# EasyEDA Pro project controller_2.eprj

# Schematic Schematic
Board Name: controller_2; Create Date: 2026-01-03; Page Name: P1; Project Name: controller_2; Schematic Name: Schematic2; Update Date: 2026-01-03; Company: EasyEDA.com; Page Size: A4; Version: V1.0
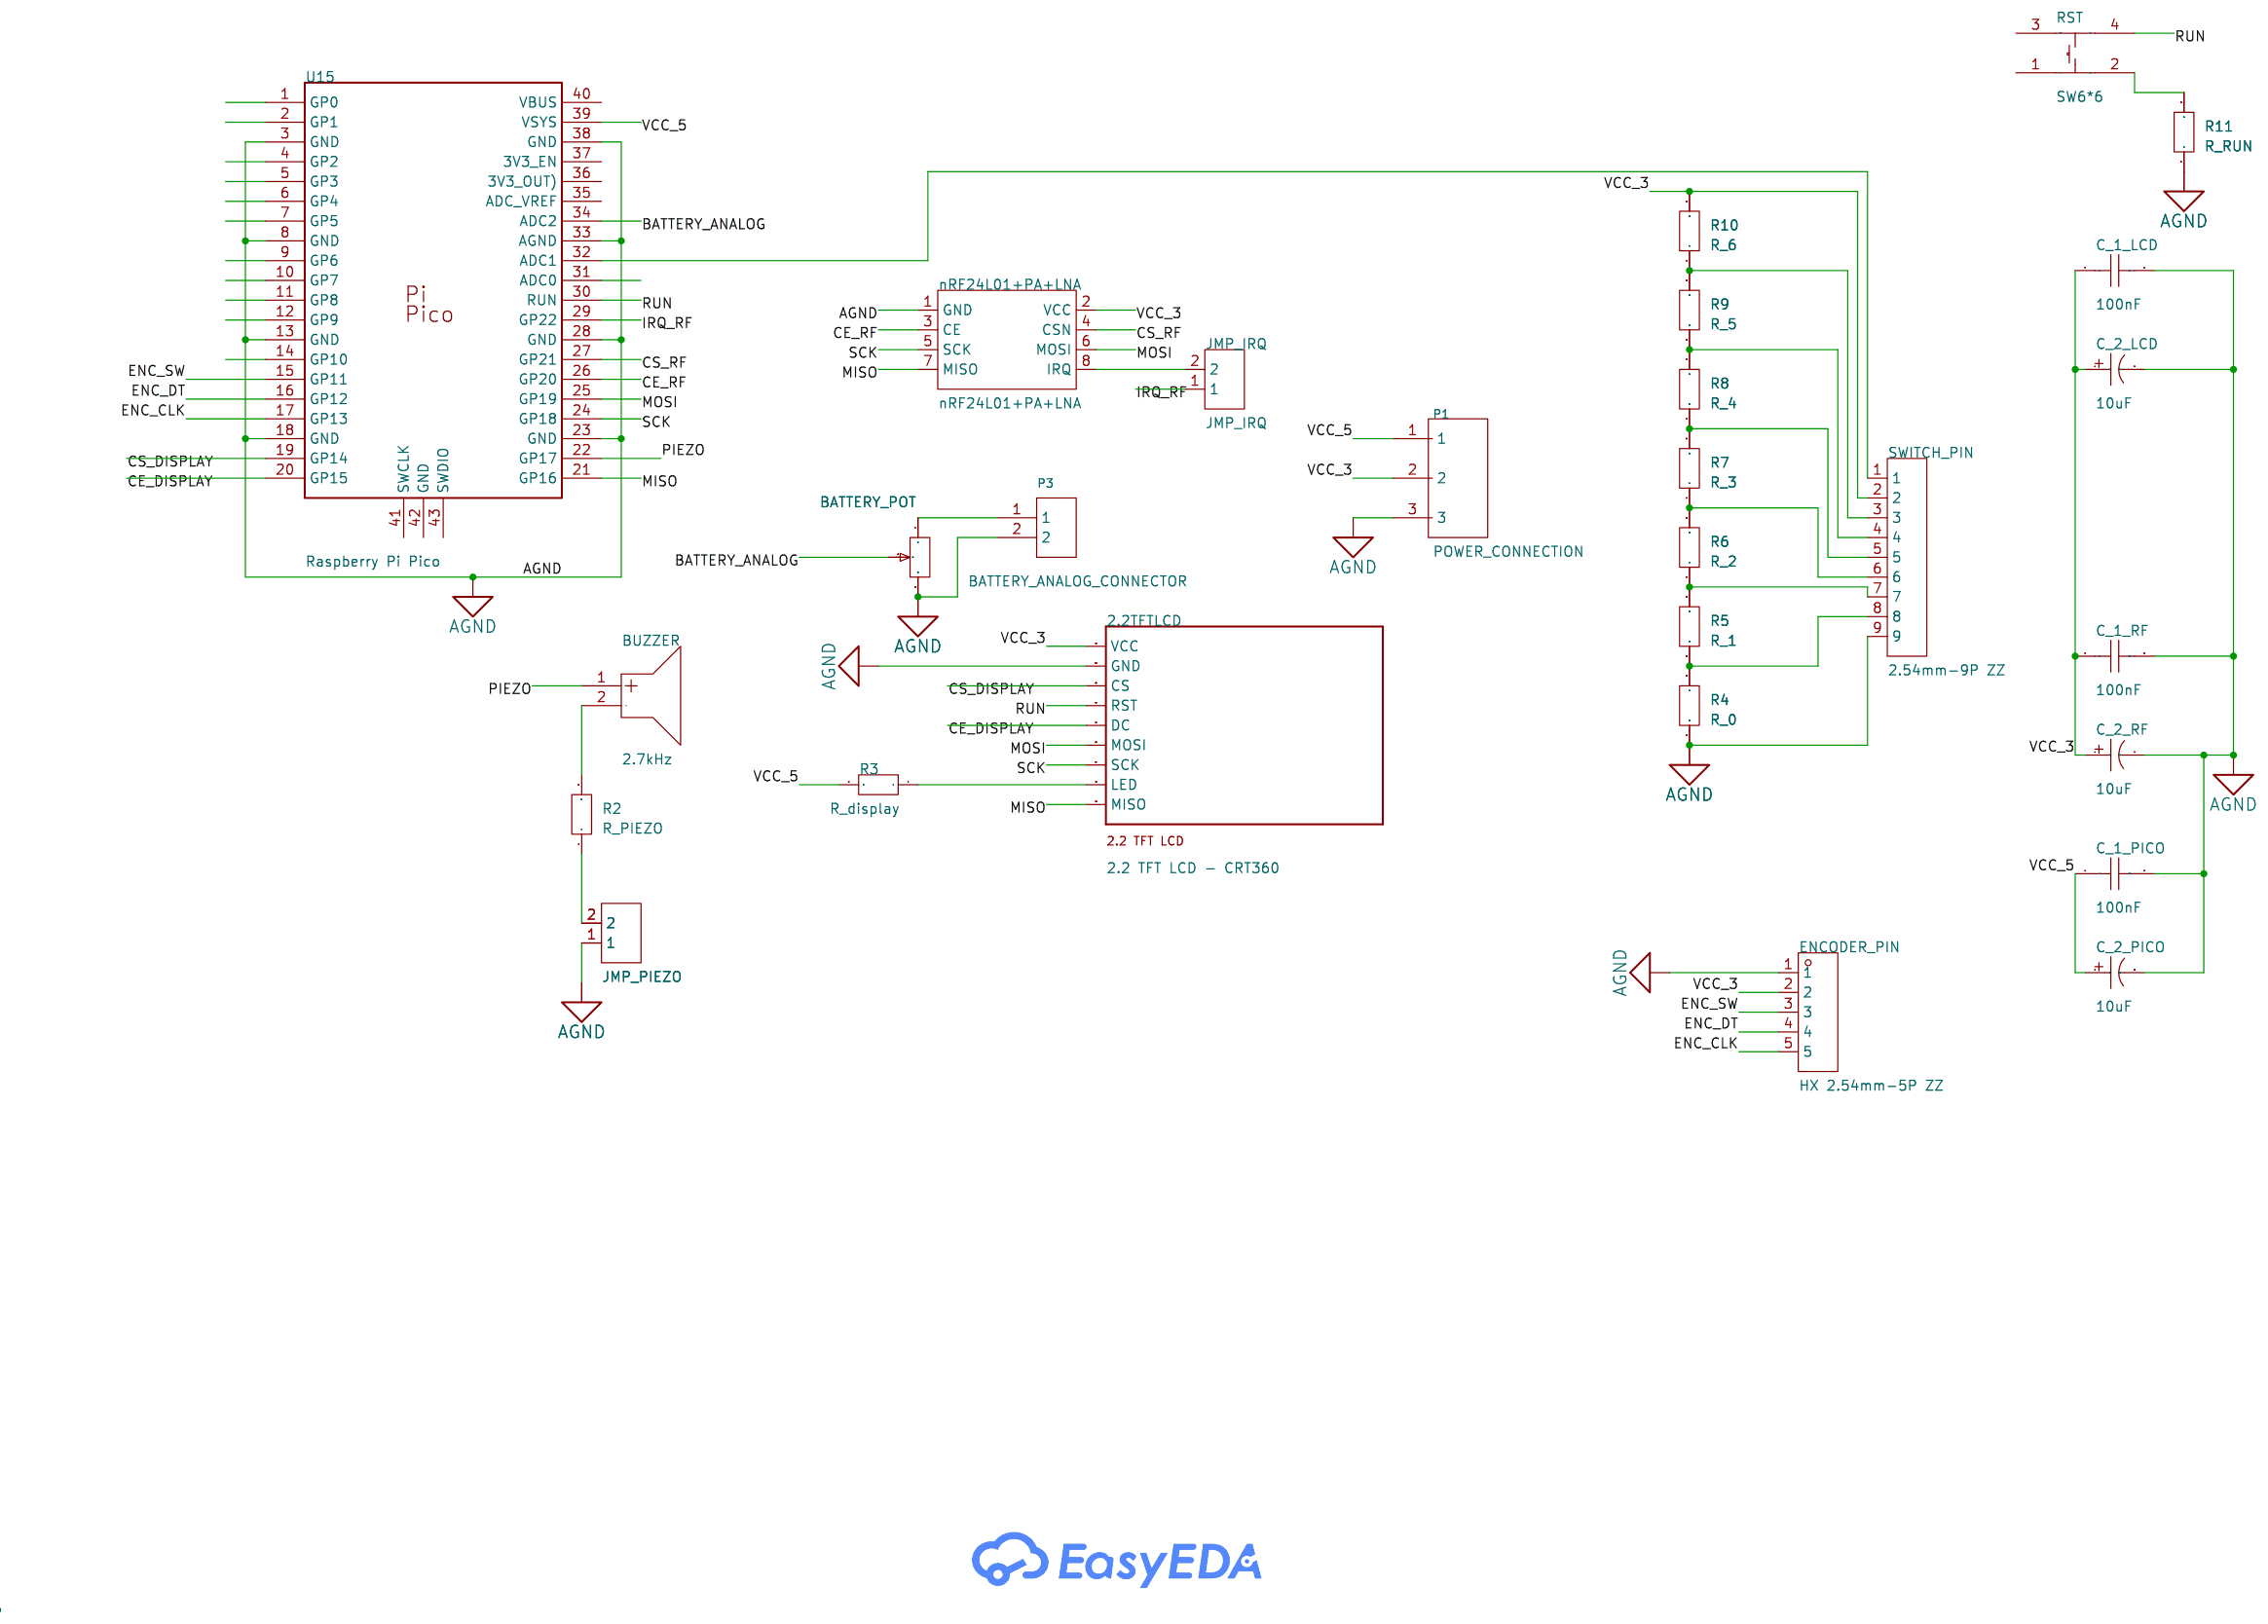
[diagram p0: schematic sheet]

## Parts
2.2TFTLCD  2.2 TFT LCD - CRT360  [2.2_TFT_LCD]
BUZZER  2.7kHz  [BUZ-TH_BD9.0-P5.00-D0.6-FD]
C_1_LCD  100nF  [CAP-TH_L5.8-W3.6-P5.0-D0.6]
C_1_PICO  100nF  [CAP-TH_L5.8-W3.6-P5.0-D0.6]
C_1_RF  100nF  [CAP-TH_L5.8-W3.6-P5.0-D0.6]
C_2_LCD  10uF  [CAP-TH_BD5.0-P2.00-D0.5-FD]
C_2_PICO  10uF  [CAP-TH_BD5.0-P2.00-D0.5-FD]
C_2_RF  10uF  [CAP-TH_BD5.0-P2.00-D0.5-FD]
ENCODER_PIN  HX 2.54mm-5P ZZ  [CONN-TH_5P-P2.50_HX-2.54MM-5P-ZZ]
H2  JMP_PIEZO  [HDR-TH_2P-P2.54-V-M]
JMP_IRQ  JMP_IRQ  [HDR-TH_2P-P2.54-V-M]
nRF24L01+PA+LNA  nRF24L01+PA+LNA  [COMM-TH_L41.0-W15.5-P2.54_NRF24L01]
P1  POWER_CONNECTION  [CONN-TH_3P-P5.00_WJ126V-5.0-3P]
P3  BATTERY_ANALOG_CONNECTOR  [CONN-TH_2P-P5.00_WJ301V-5.00-2P]
R1  20kΩ  [RES-ADJ-TH_3296X]
R2  10kΩ  [RES-TH_BD2.7-L6.2-P10.20-D0.4]
R3  10kΩ  [RES-TH_BD2.7-L6.2-P10.20-D0.4]
R4  10kΩ  [RES-TH_BD2.7-L6.2-P10.20-D0.4]
R5  10kΩ  [RES-TH_BD2.7-L6.2-P10.20-D0.4]
R6  10kΩ  [RES-TH_BD2.7-L6.2-P10.20-D0.4]
R7  10kΩ  [RES-TH_BD2.7-L6.2-P10.20-D0.4]
R8  10kΩ  [RES-TH_BD2.7-L6.2-P10.20-D0.4]
R9  10kΩ  [RES-TH_BD2.7-L6.2-P10.20-D0.4]
R10  10kΩ  [RES-TH_BD2.7-L6.2-P10.20-D0.4]
R11  10kΩ  [RES-TH_BD2.7-L6.2-P10.20-D0.4]
RST  SW6*6  [KEY-TH_4P-L6.0-W6.0-P4.5-LS6.5-TL]
SWITCH_PIN  2.54mm-9P ZZ  [CONN-TH_9P-P2.50_HX-2.54MM-9P-ZZ]
U15  Raspberry Pi Pico  [RASPBERRY PI PICO FOOTPRINT]

## Library data of the parts
2.2TFTLCD = 2.2 TFT LCD - CRT360
BUZZER = FMB09A03-3V: Driver Circuitry:Active Buzzer (Built-in Driving Circuit) Technology:Electromagnetic Voltage - Supply:2V~4.2V Voltage - Supply:2V~4.2V Frequency:2.7kHz Sound Pressure Level(SPL):80dB Diameter(φD):9mm Height:5.7mm; LCSC Part Name: 电磁式3V 2700HZ; Supplier Part: C417385; Manufacturer: FUET(福声科技); Supplier Footprint: 插件,D=9mm; JLCPCB Part Class: Extended Part; Datasheet: https://item.szlcsc.com/datasheet/FMB09A03-3V/410518.html; Supplier: LCSC; Driver Circuitry: Active Buzzer (Built-in Driving Circuit); Technology: Electromagnetic; Voltage - Supply: 2V~4.2V; Sound Pressure Level(SPL): 80dB; Diameter(φD): 9mm; Height: 5.7mm
C_1_LCD C_1_PICO C_1_RF = 178MU0002: Capacitance:100nF Tolerance:±10% Tolerance:±10% Voltage Rating:50V Temperature Coefficient:X7R Pin Spacing:5.08mm; LCSC Part Name: 100nF ±10% 50V; Supplier Part: C5632426; Manufacturer: KNSCHA(科尼盛); Supplier Footprint: 插件,P=5.08mm; JLCPCB Part Class: Extended Part; Datasheet: https://item.szlcsc.com/datasheet/178MU0002/6552581.html; Supplier: LCSC; Tolerance: ±10%; Voltage Rating: 50V; Temperature Coefficient: X7R; Pin Spacing: 5.08mm
C_2_LCD C_2_PICO C_2_RF = 35ZLH220MEFC8X11.5: Capacitance:220uF Tolerance:±20% Tolerance:±20% Voltage Rating:35V Ripple Current:472.5mA@120Hz Pin Spacing:3.5mm Diameter:8mm Height - Seated (Max):11.5mm Lifetime:8000hrs@105℃ Operating Temperature:-40℃~+105℃ Operating Temperature:-40℃~+105℃; LCSC Part Name: 220uF ±20% 35V; Supplier Part: C107639; Manufacturer: Rubycon(红宝石); Supplier Footprint: 插件,D8xL11.5mm; JLCPCB Part Class: Extended Part; Datasheet: https://item.szlcsc.com/datasheet/35ZLH220MEFC8X11.5/108858.html; Supplier: LCSC; Tolerance: ±20%; Voltage Rating: 35V; Ripple Current: 472.5mA@120Hz; Pin Spacing: 3.5mm; Diameter: 8mm; Height - Seated (Max): 11.5mm; Lifetime: 8000hrs@105℃; Operating Temperature: -40℃~+105℃
ENCODER_PIN = HX 2.54mm-5P ZZ: LCSC Part Name: 1x5P 间距:2.5mm 直插 系列:XH; Supplier Part: C7543434; Manufacturer: hanxia(韩下); Supplier Footprint: 插件,P=2.5mm; JLCPCB Part Class: Extended Part; Datasheet: https://item.szlcsc.com/datasheet/HX%25202.54mm-5P%2520ZZ/8648040.html; Supplier: LCSC; Pins Structure: 1x5P; Pitch: 2.5mm; Mounting Type: Through Hole; Reference Series: XH; Number of Pins: 5P; Number of Rows: 1; Number of PINs Per Row: 5; Current Rating: 3A; Contact Material: Brass; Contact Plating: Tin; Operating Temperature: -25℃~+85℃; Voltage Rating: 250V; Plastic Material: PA66; Flame Retardant Rating: UL94V-0; Color: White
H2 JMP_IRQ = PZ254V-11-02P: Pin Structure:1x2P Pitch:2.54mm Row Spacing:- Circluar Pins/Square Pins:Pin Header Mounting Type:Through Hole Number of Rows:1 Number of Pins:2P Current Rating:- Voltage Rating (Max):- Length of Mating Pin:6mm Insulation Height:2.5mm Length of End Connect; LCSC Part Name: 1x2P 间距:2.54mm 方针 直插; Supplier Part: C492401; Manufacturer: XFCN(兴飞); Supplier Footprint: 插件,P=2.54mm; JLCPCB Part Class: Extended Part; Datasheet: https://item.szlcsc.com/datasheet/PZ254V-11-02P/502957.html; Supplier: LCSC; Pin Structure: 1x2P; Pitch: 2.54mm; Circluar Pins/Square Pins: Pin Header; Mounting Type: Through Hole; Number of Rows: 1; Number of Pins: 2P; Length of Mating Pin: 6mm; Insulation Height: 2.5mm; Length of End Connection Pin: 3mm; Contact Material: Brass; Operating Temperature: -40℃~+105℃; Color: Black
nRF24L01+PA+LNA = nRF24L01+PA+LNA: Supplier Part: C9900187674; JLCPCB Part Class: Extended Part; Supplier: LCSC
P1 = WJ126V-5.0-3P: Structure:1x3P Pitch:5mm Color:Green Mounting Style:Straight Current Rating (Max):18A Voltage Rating (Max):250V Number of Pins:3P Number of Rows:1 Wire Gauge - AWG:14~26 Wire Gauge - AWG:14~26 Wire Gauge - mm2:2.5 Wire Gauge - mm2:2.5 Number of PINs Per R; LCSC Part Name: 5mm 1x3P 排数:1 每排P数:3 直插; Supplier Part: C8401; Manufacturer: KANGNEX(康奈克斯电气); Supplier Footprint: 插件,P=5mm; JLCPCB Part Class: Extended Part; Datasheet: https://atta.szlcsc.com/upload/public/pdf/source/20191225/C8401_BC4AEF85CCBF7CDF5CCE64583ADD1E63.pdf; Supplier: LCSC; Structure: 1x3P; Pitch: 5mm; Color: Green; Mounting Style: Straight; Current Rating (Max): 18A; Voltage Rating (Max): 250V; Number of Pins: 3P; Number of Rows: 1; Wire Gauge - AWG: 14~26; Wire Gauge - mm2: 2.5; Number of PINs Per Row: 3; Operating Temperature Range: -40℃~+105℃
P3 = WJ301V-5.0-2P: Number of Positions or Pins:1x2P Pitch:5mm Color:Blue Mounting Type:Through Hole Number of Pins:2P Number of Rows:1 Number of PINs Per Row:2 Current Rating:17.5A Voltage Rating (Max):250V Wire Gauge - AWG:14~22 Wire Gauge - AWG:14~22 Wire Gauge - mm2:1.5; LCSC Part Name: 5mm 1x2P 排数:1 每排P数:2 直插; Supplier Part: C8475; Manufacturer: KANGNEX(康奈克斯电气); Supplier Footprint: 插件,P=5mm; JLCPCB Part Class: Extended Part; Datasheet: https://item.szlcsc.com/datasheet/WJ301V-5.0-2P/8969.html; Supplier: LCSC; Number of Positions or Pins: 1x2P; Pitch: 5mm; Color: Blue; Mounting Type: Through Hole; Number of Pins: 2P; Number of Rows: 1; Number of PINs Per Row: 2; Current Rating: 17.5A; Voltage Rating (Max): 250V; Wire Gauge - AWG: 14~22; Wire Gauge - mm2: 1.5; Operating Temperature: -30℃~+120℃
R1 = 3296X-203: Resistance:20kΩ Tolerance:±10% Tolerance:±10% Power(Watts):500mW Temperature Coefficient:±250ppm/℃ Temperature Coefficient:±250ppm/℃ Number of Turns:28; LCSC Part Name: 3296X 20KΩ±10%; Supplier Part: C48641797; Manufacturer: BAOTER(宝特); Supplier Footprint: 插件-3P,9.5x4.8mm; JLCPCB Part Class: Extended Part; Datasheet: https://item.szlcsc.com/datasheet/3296X-203/50920059.html; Supplier: LCSC; Tolerance: ±10%; Power(Watts): 500mW; Temperature Coefficient: ±250ppm/℃; Number of Turns: 28
R2-R11 = MF02SFF1002A10: Type:Metal Film Resistor Resistance:10kΩ Tolerance:±1% Tolerance:±1% Power(Watts):2W Temperature Coefficient:±50ppm/℃ Temperature Coefficient:±50ppm/℃; Supplier Part: C20625289; Manufacturer: UNI-ROYAL(厚声); Supplier Footprint: DIP; JLCPCB Part Class: Extended Part; Datasheet: https://item.szlcsc.com/datasheet/MF02SFF1002A10/22028782.html; Supplier: LCSC; Type: Metal Film Resistor; Tolerance: ±1%; Power(Watts): 2W; Temperature Coefficient: ±50ppm/℃
RST = SW6*6: Supplier Part: C9900009250; Supplier Footprint: SW-TH; JLCPCB Part Class: Extended Part; Supplier: LCSC
SWITCH_PIN = 2.54mm-9P ZZ: LCSC Part Name: 米色 2.54-9P直针 白色不耐温; Supplier Part: C5368782; Manufacturer: SHOU HAN(首韩); Supplier Footprint: 插件,P=2.5mm; JLCPCB Part Class: Extended Part; Datasheet: https://item.szlcsc.com/datasheet/2.54mm-9P%2520ZZ/6208424.html; Supplier: LCSC; Pins Structure: 1x9P; Pitch: 2.5mm; Mounting Type: Through Hole; Reference Series: XH; Number of Pins: 9P; Number of Rows: 1; Number of PINs Per Row: 9; Current Rating: 3A; Contact Material: Brass; Contact Plating: Tin; Operating Temperature: -25℃~+85℃; Voltage Rating: 250V; Plastic Material: PA66; Flame Retardant Rating: UL94V-0; Color: White
U15 = Raspberry Pi Pico: Manufacturer: Raspberry Pi; Manufacturer Part: Pi Pico; Supplier: Core Electronics; Supplier Part: Pi Pico; link: https://www.raspberrypi.org/documentation/rp2040/getting-started/

## Nets
AGND: 2.2TFTLCD.GND C_1_LCD.2 C_1_PICO.2 C_1_RF.2 C_2_LCD.2 C_2_PICO.2 C_2_RF.2 ENCODER_PIN.1 H2.1 nRF24L01+PA+LNA.1(GND) P1.3 P3.2 R1.3 R4.1 R11.1 SWITCH_PIN.9 U15.3(GND) U15.8(GND) U15.13(GND) U15.18(GND) U15.23(GND) U15.28(GND) U15.33(AGND) U15.38(GND)
VCC_3: 2.2TFTLCD.VCC C_1_LCD.1 C_1_RF.1 C_2_LCD.1 C_2_RF.1 ENCODER_PIN.2 nRF24L01+PA+LNA.2(VCC) P1.2 R10.2 SWITCH_PIN.2
VCC_5: C_1_PICO.1 C_2_PICO.1 P1.1 R3.2 U15.39(VSYS)
BATTERY_ANALOG: R1.2 U15.34(ADC2)
CE_DISPLAY: 2.2TFTLCD.DC U15.20(GP15)
CE_RF: nRF24L01+PA+LNA.3(CE) U15.26(GP20)
CS_DISPLAY: 2.2TFTLCD.CS U15.19(GP14)
CS_RF: nRF24L01+PA+LNA.4(CSN) U15.27(GP21)
ENC_CLK: ENCODER_PIN.5 U15.17(GP13)
ENC_DT: ENCODER_PIN.4 U15.16(GP12)
ENC_SW: ENCODER_PIN.3 U15.15(GP11)
IRQ_RF: JMP_IRQ.1 U15.29(GP22)
MISO: 2.2TFTLCD.MISO nRF24L01+PA+LNA.7(MISO) U15.21(GP16)
MOSI: 2.2TFTLCD.MOSI nRF24L01+PA+LNA.6(MOSI) U15.25(GP19)
PIEZO: BUZZER.1(+) U15.22(GP17)
RUN: 2.2TFTLCD.RST RST.4 U15.30(RUN)
SCK: 2.2TFTLCD.SCK nRF24L01+PA+LNA.5(SCK) U15.24(GP18)
$1N9361: P3.1 R1.1
$1N10835: H2.2 R2.1
$1N10839: BUZZER.2(-) R2.2
$1N17067: R11.2 RST.2
$1N20120: JMP_IRQ.2 nRF24L01+PA+LNA.8(IRQ)
$1N20161: 2.2TFTLCD.LED R3.1
$1N20266: R4.2 R5.1 SWITCH_PIN.8
$1N20338: R6.2 R7.1 SWITCH_PIN.6
$1N20340: R5.2 R6.1 SWITCH_PIN.7
$1N20482: R8.2 R9.1 SWITCH_PIN.4
$1N20486: R9.2 R10.1 SWITCH_PIN.3
$1N20488: R7.2 R8.1 SWITCH_PIN.5
$1N20737: SWITCH_PIN.1 U15.32(ADC1)

Not connected (* = marked no-connect by the designer): RST 1 3; U15 1(GP0) 2(GP1) 4(GP2) 5(GP3) 6(GP4) 7(GP5) 9(GP6) 10(GP7) 11(GP8) 12(GP9) 14(GP10) 31(ADC0) 35(ADC VREF) 36(3V3 OUT)) 37(3V3_EN) 40(VBUS) 41(SWCLK) 42(GND) 43(SWDIO)

# Board PCB3
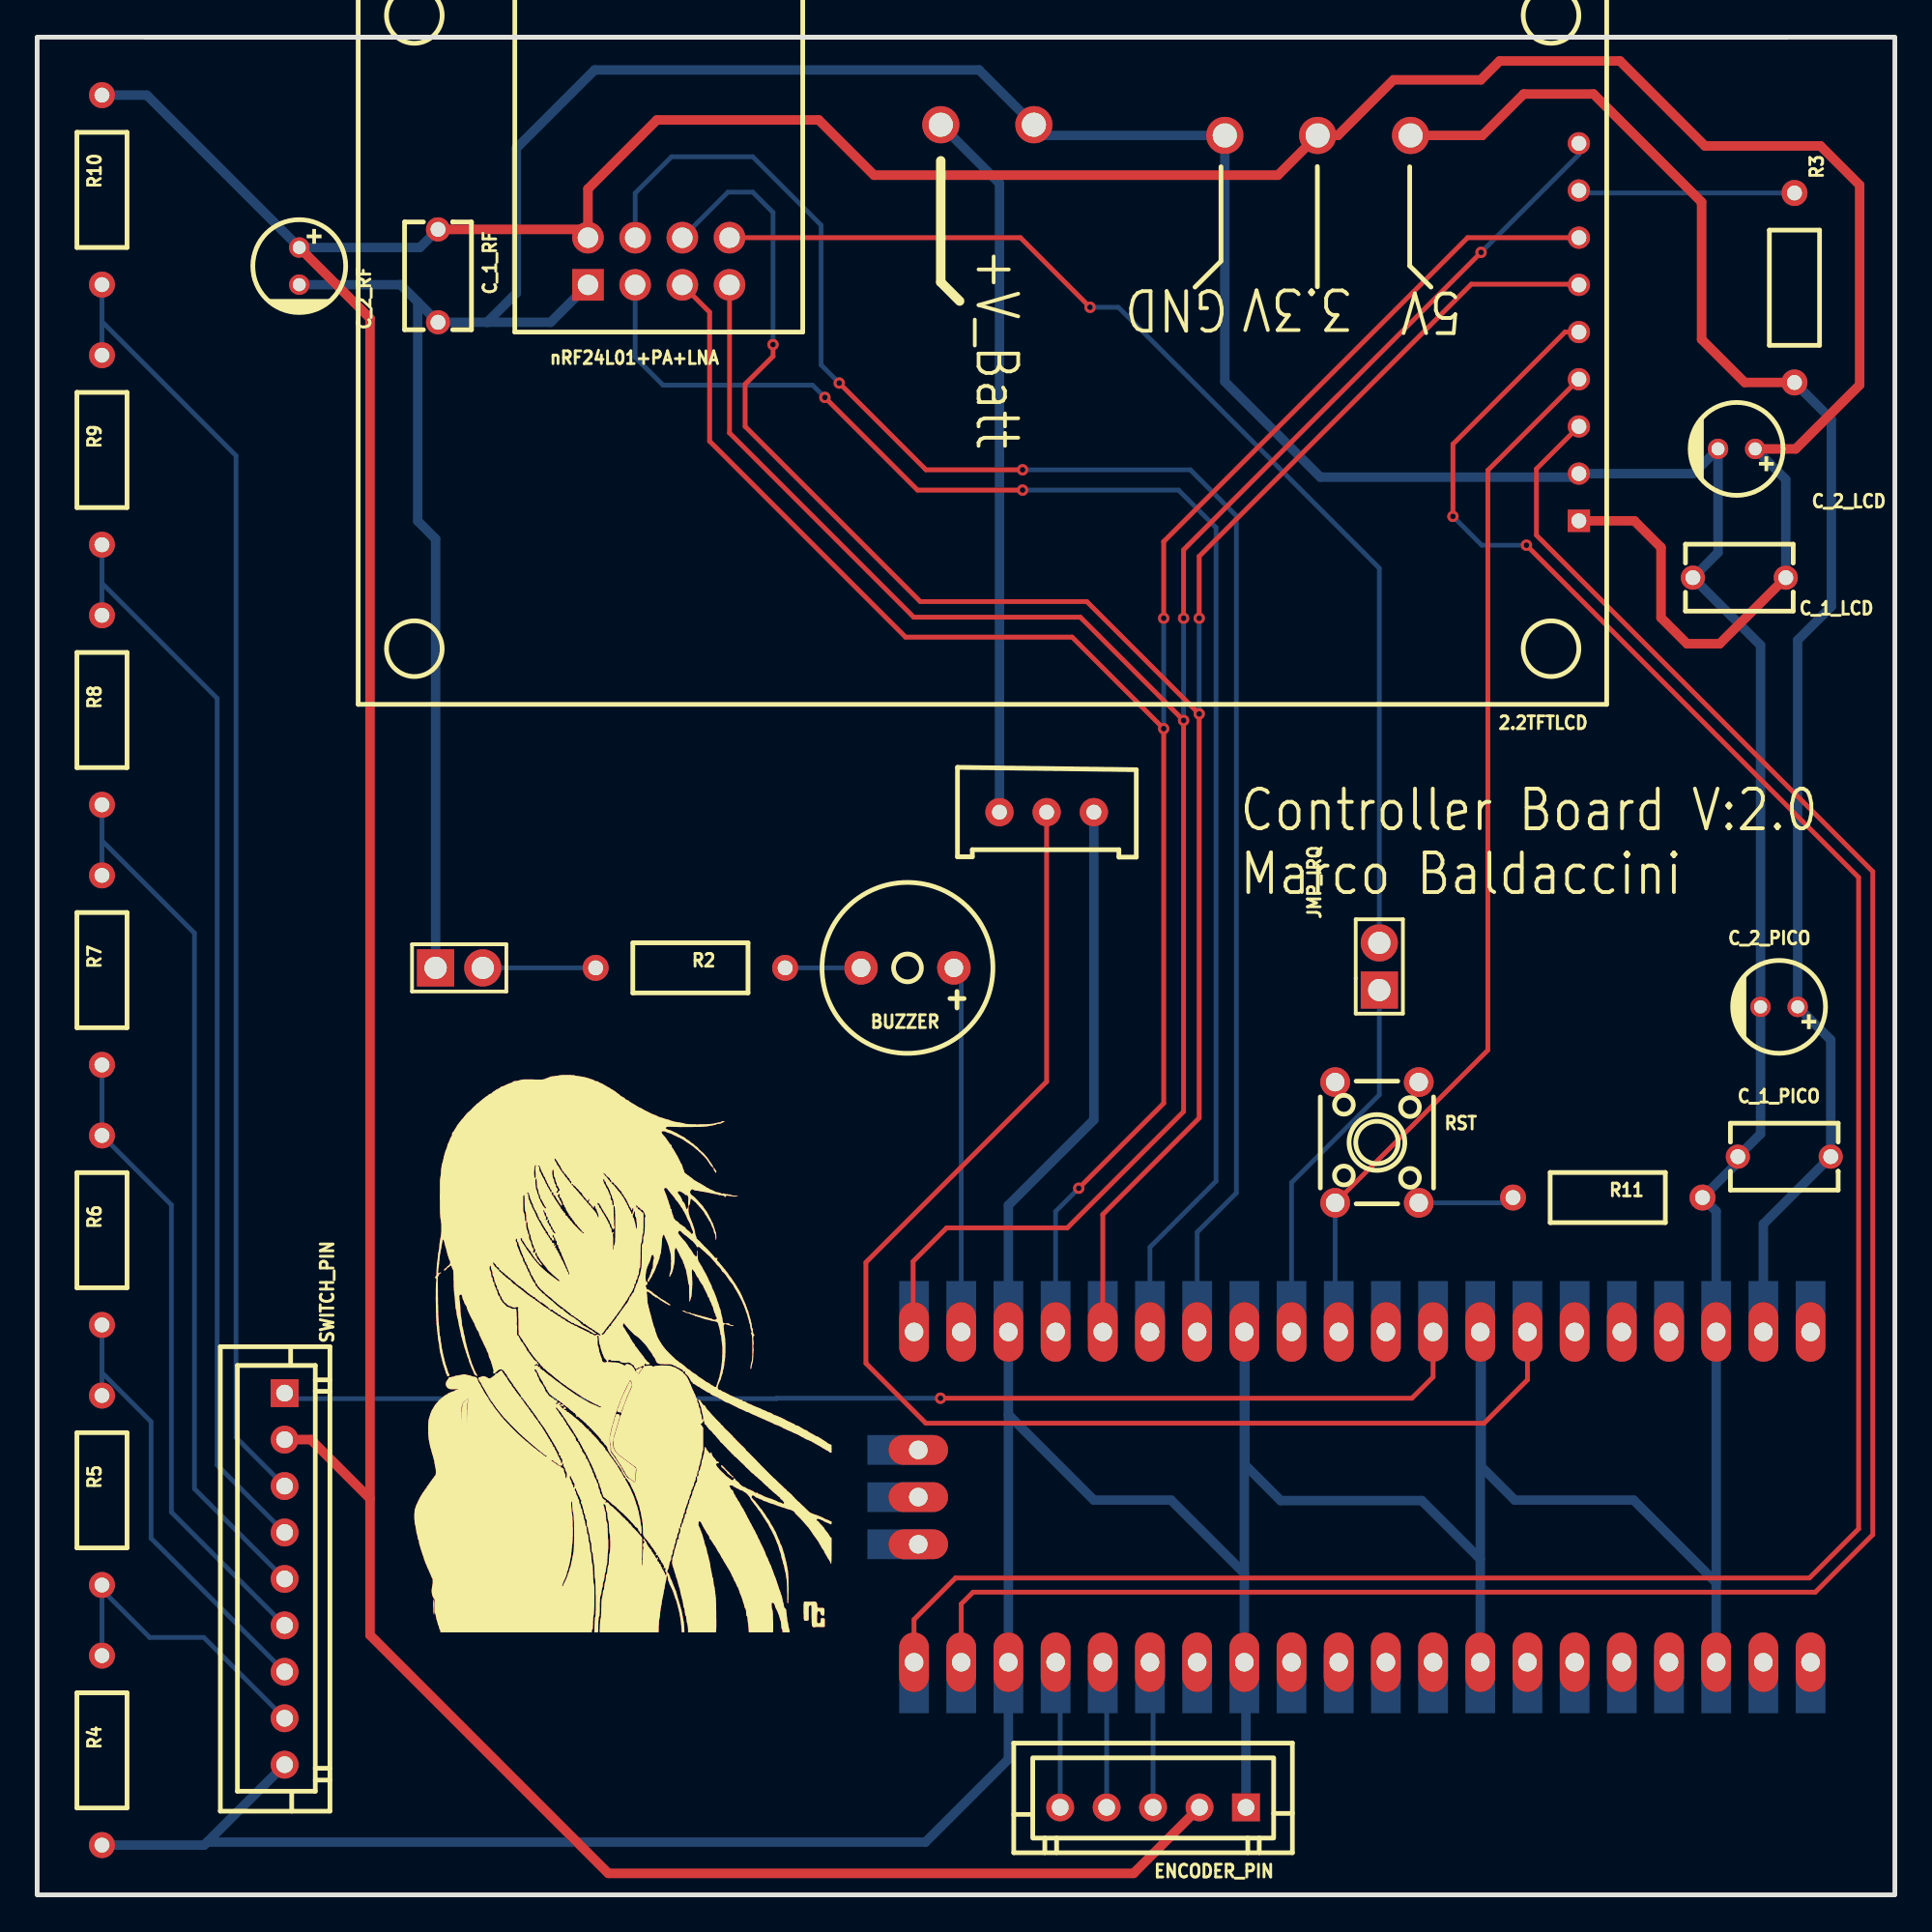
[diagram p1: board, top side]
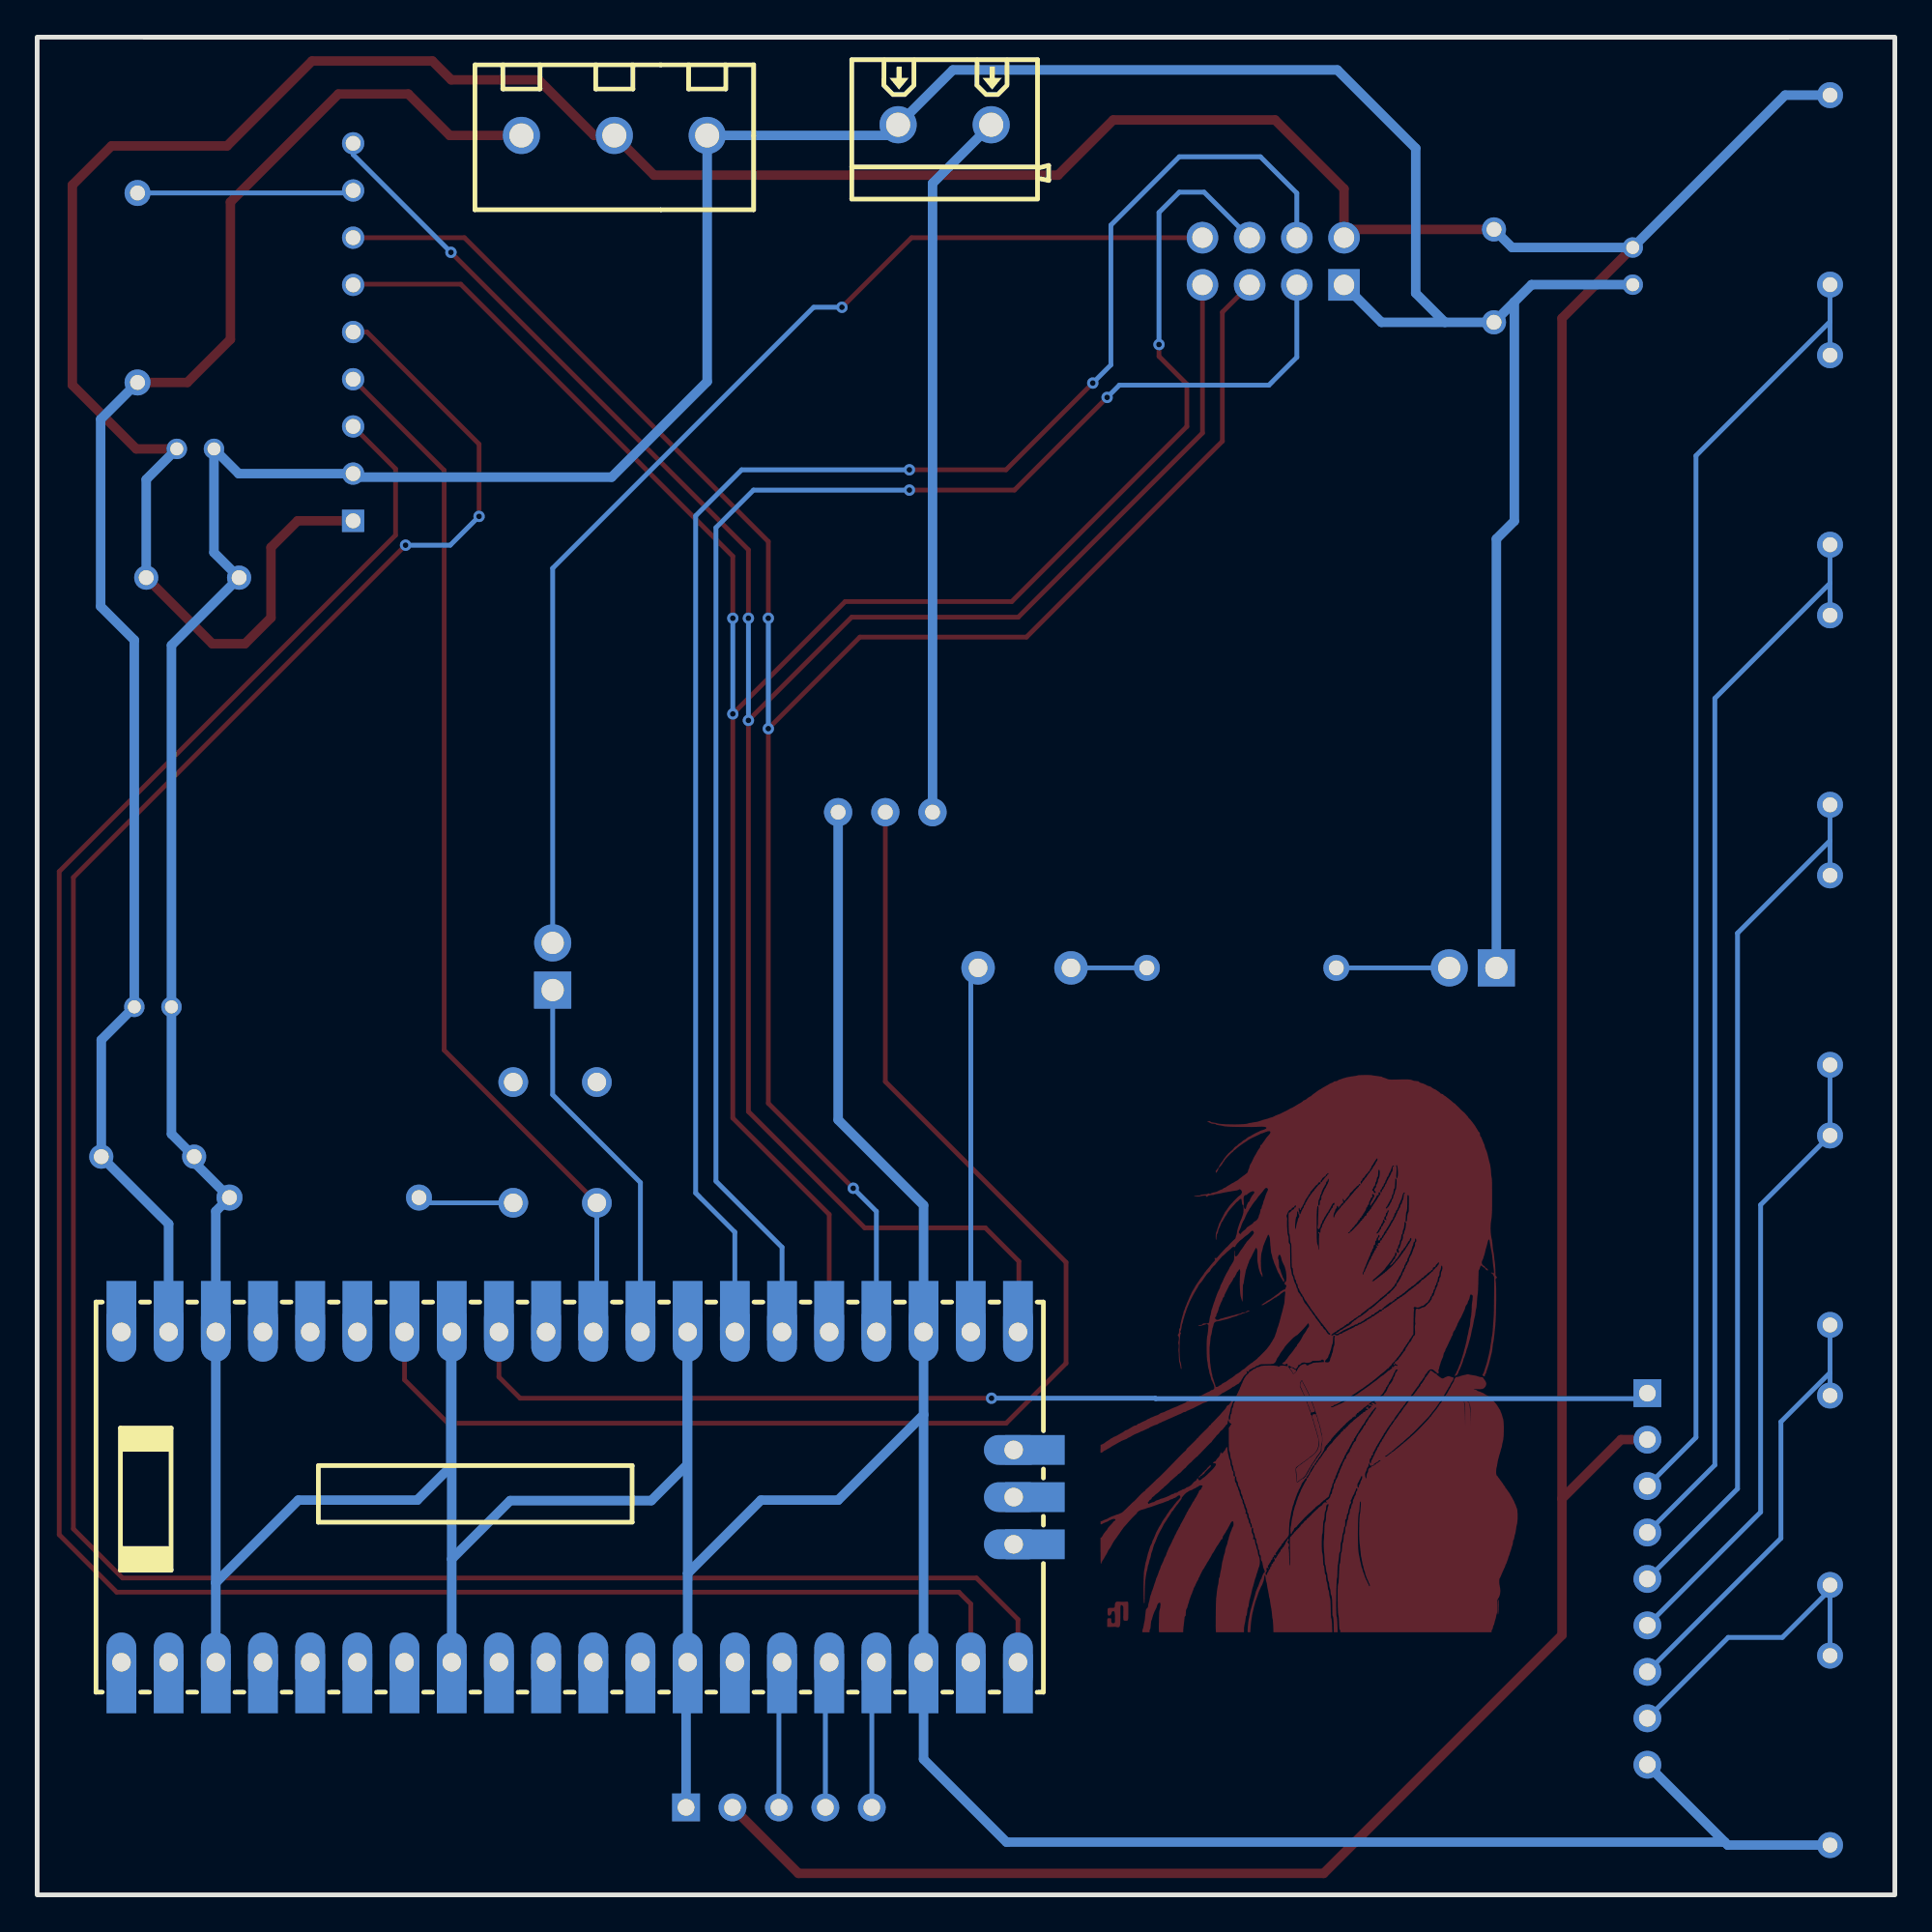
[diagram p2: board, bottom side, seen from below]

Outline 100 x 100 mm; copper layers: Top Layer, Bottom Layer. Coordinates in mm from the lower left corner of the outline.
Outline path: rectangle 0,100 100,0 ; 5.79,100 72.83,100 ; 26.11,100 94.21,100
Stack: Top Layer 0.035mm / Dielectric1 1.51mm FR4 er 4.5 / Bottom Layer 0.035mm

## Design rules (mm)
template: JLCPCB Capability(Two Layers Board)
spacing copperThickness1oz (default): track to track 0.102, other pairs 0.152 to 0.3
spacing copperThickness2oz: track to track 0.203, other pairs 0.152 to 0.3
track width copperThickness1oz (default): min 0.127, default 0.254, max 2.54
track width copperThickness2oz: min 0.203, default 0.254, max 2.54
differential pair differentialPair (default): width min 0.127, default 0.254, max 2.54; gap min 0.152, default 0.152
via viaSize (default): diameter min 0.5, default 0.61, max 10; hole min 0.3, default 0.305, max 6.3

## Placement (name value [footprint] x y rotation side)
2.2TFTLCD  2.2 TFT LCD - CRT360  [2.2_TFT_LCD]  82.99 73.97 180 top
BUZZER  2.7kHz  [BUZ-TH_BD9.0-P5.00-D0.6-FD]  46.85 49.9 180 top
C_1_LCD  100nF  [CAP-TH_L5.8-W3.6-P5.0-D0.6]  91.63 70.91 180 top
C_1_PICO  100nF  [CAP-TH_L5.8-W3.6-P5.0-D0.6]  94.05 39.74 180 top
C_1_RF  100nF  [CAP-TH_L5.8-W3.6-P5.0-D0.6]  21.58 87.15 270 top
C_2_LCD  10uF  [CAP-TH_BD5.0-P2.00-D0.5-FD]  91.48 77.84 180 top
C_2_PICO  10uF  [CAP-TH_BD5.0-P2.00-D0.5-FD]  93.77 47.8 180 top
C_2_RF  10uF  [CAP-TH_BD5.0-P2.00-D0.5-FD]  14.11 87.68 270 top
ENCODER_PIN  HX 2.54mm-5P ZZ  [CONN-TH_5P-P2.50_HX-2.54MM-5P-ZZ]  60.07 4.71 180 top
H2  JMP_PIEZO  [HDR-TH_2P-P2.54-V-M]  22.72 49.9 0 top
JMP_IRQ  JMP_IRQ  [HDR-TH_2P-P2.54-V-M]  72.25 49.97 90 top
nRF24L01+PA+LNA  nRF24L01+PA+LNA  [COMM-TH_L41.0-W15.5-P2.54_NRF24L01]  33.46 87.94 90 top
P1  POWER_CONNECTION  [CONN-TH_3P-P5.00_WJ126V-5.0-3P]  68.93 94.55 0 bottom
P3  BATTERY_ANALOG_CONNECTOR  [CONN-TH_2P-P5.00_WJ301V-5.00-2P]  51.15 95.29 0 bottom
R1  20kΩ  [RES-ADJ-TH_3296X]  54.34 58.28 90 top
R2  10kΩ  [RES-TH_BD2.7-L6.2-P10.20-D0.4]  35.17 49.9 0 top
R3  10kΩ  [RES-TH_BD2.7-L6.2-P10.20-D0.4]  94.6 86.51 270 top
R4  10kΩ  [RES-TH_BD2.7-L6.2-P10.20-D0.4]  3.49 7.78 90 top
R5  10kΩ  [RES-TH_BD2.7-L6.2-P10.20-D0.4]  3.49 21.78 90 top
R6  10kΩ  [RES-TH_BD2.7-L6.2-P10.20-D0.4]  3.49 35.78 90 top
R7  10kΩ  [RES-TH_BD2.7-L6.2-P10.20-D0.4]  3.49 49.78 90 top
R8  10kΩ  [RES-TH_BD2.7-L6.2-P10.20-D0.4]  3.49 63.78 90 top
R9  10kΩ  [RES-TH_BD2.7-L6.2-P10.20-D0.4]  3.49 77.78 90 top
R10  10kΩ  [RES-TH_BD2.7-L6.2-P10.20-D0.4]  3.49 91.78 90 top
R11  10kΩ  [RES-TH_BD2.7-L6.2-P10.20-D0.4]  84.55 37.53 180 top
RST  SW6*6  [KEY-TH_4P-L6.0-W6.0-P4.5-LS6.5-TL]  72.12 40.5 270 top
SWITCH_PIN  2.54mm-9P ZZ  [CONN-TH_9P-P2.50_HX-2.54MM-9P-ZZ]  13.32 17.01 270 top
U15  Raspberry Pi Pico  [RASPBERRY PI PICO FOOTPRINT]  45.83 10.91 90 bottom

## Footprints (pads in the part's own frame, mm; a bottom-side part is the same pattern mirrored in y, then rotated)
2.2_TFT_LCD
  round 1.199 hole 0.797: CS(0,-5.08) DC(0,-10.16) GND(0,-2.54) LED(0,-17.78) MISO(0,-20.32) MOSI(0,-12.7) RST(0,-7.62) SCK(0,-15.24)
  rect 1.199x1.199 hole 0.797: VCC(0,0)
BUZ-TH_BD9.0-P5.00-D0.6-FD
  round 1.8 hole 1: 1(-2.5,0) 2(2.5,0)
CAP-TH_BD5.0-P2.00-D0.5-FD
  round 1.1 hole 0.7: 1(-1,0) 2(1,0)
CAP-TH_L5.8-W3.6-P5.0-D0.6
  round 1.3 hole 0.8: 1(-2.5,0) 2(2.5,0)
COMM-TH_L41.0-W15.5-P2.54_NRF24L01
  rect 1.7x1.7 hole 1.1: 1(-1.27,3.81)
  round 1.7 hole 1.1: 2(1.27,3.81) 3(-1.27,1.27) 4(1.27,1.27) 5(-1.27,-1.27) 6(1.27,-1.27) 7(-1.27,-3.81) 8(1.27,-3.81)
CONN-TH_2P-P5.00_WJ301V-5.00-2P
  round 2 hole 1.3: 1(-2.505,0) 2(2.505,0)
CONN-TH_3P-P5.00_WJ126V-5.0-3P
  round 2 hole 1.3: 1(5,-0.163) 2(-0.002,-0.163) 3(-5,-0.163)
CONN-TH_5P-P2.50_HX-2.54MM-5P-ZZ
  rect 1.5x1.5 hole 0.9: 1(-5,0)
  round 1.5 hole 0.9: 2(-2.5,0) 3(0,0) 4(2.5,0) 5(5,0)
CONN-TH_9P-P2.50_HX-2.54MM-9P-ZZ
  rect 1.5x1.5 hole 0.9: 1(-10,0)
  round 1.5 hole 0.9: 2(-7.5,0) 3(-5,0) 4(-2.5,0) 5(0,0) 6(2.5,0) 7(5,0) 8(7.5,0) 9(10,0)
HDR-TH_2P-P2.54-V-M
  rect 2x2 hole 1.2: 1(-1.27,0)
  round 2 hole 1.2: 2(1.27,0)
KEY-TH_4P-L6.0-W6.0-P4.5-LS6.5-TL
  round 1.6 hole 1: 1(-3.25,2.25) 2(3.25,2.25) 3(-3.25,-2.25) 4(3.25,-2.25)
RASPBERRY PI PICO FOOTPRINT
  rect 3.2x1.6 smd: 1(0.467,49.63) 2(0.467,47.09) 3(0.467,44.55) 4(0.467,42.01) 5(0.467,39.47) 6(0.467,36.93) 7(0.467,34.39) 8(0.467,31.85) 9(0.467,29.31) 10(0.467,26.77) 11(0.467,24.23) 12(0.467,21.69) 13(0.467,19.15) 14(0.467,16.61) 15(0.467,14.07) 16(0.467,11.53) 17(0.467,8.99) 18(0.467,6.45) 19(0.467,3.91) 20(0.467,1.37) 21(20.533,1.37) 22(20.533,3.91) 23(20.533,6.45) 24(20.533,8.99) 25(20.533,11.53) 26(20.533,14.07) 27(20.533,16.61) 28(20.533,19.15) 29(20.533,21.69) 30(20.533,24.23) 31(20.533,26.77) 32(20.533,29.31) 33(20.533,31.85) 34(20.533,34.39) 35(20.533,36.93) 36(20.533,39.47) 37(20.533,42.01) 38(20.533,44.55) 39(20.533,47.09) 40(20.533,49.63)
  oval 3.2x1.6 hole 1: 1(1.61,49.63) 2(1.61,47.09) 3(1.61,44.55) 4(1.61,42.01) 5(1.61,39.47) 6(1.61,36.93) 7(1.61,34.39) 8(1.61,31.85) 9(1.61,29.31) 10(1.61,26.77) 11(1.61,24.23) 12(1.61,21.69) 13(1.61,19.15) 14(1.61,16.61) 15(1.61,14.07) 16(1.61,11.53) 17(1.61,8.99) 18(1.61,6.45) 19(1.61,3.91) 20(1.61,1.37) 21(19.39,1.37) 22(19.39,3.91) 23(19.39,6.45) 24(19.39,8.99) 25(19.39,11.53) 26(19.39,14.07) 27(19.39,16.61) 28(19.39,19.15) 29(19.39,21.69) 30(19.39,24.23) 31(19.39,26.77) 32(19.39,29.31) 33(19.39,31.85) 34(19.39,34.39) 35(19.39,36.93) 36(19.39,39.47) 37(19.39,42.01) 38(19.39,44.55) 39(19.39,47.09) 40(19.39,49.63)
  rect 1.6x3.2 smd: 41(7.96,0.457) 42(10.5,0.457) 43(13.04,0.457)
  oval 1.6x3.2 hole 1: 41(7.96,1.6) 42(10.5,1.6) 43(13.04,1.6)
RES-ADJ-TH_3296X
  round 1.524 hole 0.8: 1(0,2.54) 2(0,0) 3(0,-2.54)
RES-TH_BD2.7-L6.2-P10.20-D0.4
  round 1.4 hole 0.8: 1(-5.1,0) 2(5.1,0)

## Nets
As in the schematic.

Pads without a net: RST 1 3; U15 35 36 37 40 41 42 43

## Via types
v1: diameter 0.61, hole 0.305, Top Layer to Bottom Layer, 17 vias

## Routing (per net, layer and track width the routed paths; a pad name or vN(x,y) marks a point on that pad's centre or on a via; arc(x,y) is an arc through that point)
AGND: length 429.2
  Bottom Layer w0.508: nRF24L01+PA+LNA.1 27.64,84.65 24.22,84.65 ; U15.13 64.98,17.3 ; 64.98,17.3 U15.28 65.01,30.27 65.01,23.15 66.94,21.22 74.54,21.22 77.68,18.07 ; 64.98,17.3 61.04,21.25 56.88,21.25 52.28,25.85 ; 9.15,2.84 SWITCH_PIN.9 ; 9.15,2.84 8.99,2.68 R4.1 ; 9.15,2.84 47.82,2.84 52.28,7.3 52.28,12.75 ; 20.48,85.75 19.56,86.68 C_2_RF.2 ; 20.48,85.75 20.48,73.95 21.45,72.99 H2.1 ; 20.48,85.75 C_1_RF.2 24.22,84.65 ; 24.22,84.65 25.79,86.22 25.79,94.02 30.01,98.23 50.7,98.23 P3.2 54.23,94.71 P1.3 63.93,81.46 69.07,76.31 82.8,76.31 82.99,76.5 89.15,76.5 C_2_LCD.2 90.48,72.26 C_1_LCD.2 92.77,67.26 C_2_PICO.2 92.77,40.96 C_1_PICO.2 91.55,39.44 R11.1 90.38,36.8 90.38,31.44 ; U15.18 52.28,25.85 ; 90.38,16.8 85.94,21.25 79.54,21.25 77.74,23.05 77.74,30.25 U15.33 77.68,18.07 ; 90.38,16.8 90.38,30.3 ; 90.38,16.8 90.38,12.52 ; R1.3 56.88,41.72 52.28,37.12 U15.23 52.28,25.85 ; ENCODER_PIN.1 65.07,12.52 65.19,12.64 ; 77.68,18.07 U15.8
VCC_3: length 285.9
  Top Layer w0.508: 17.92,21.32 17.92,84.87 C_2_RF.1 ; 17.92,21.32 17.92,13.98 30.75,1.16 59.02,1.16 ENCODER_PIN.2 ; 17.92,21.32 14.74,24.51 SWITCH_PIN.2 ; C_1_RF.1 29.21,89.65 nRF24L01+PA+LNA.2 29.65,91.83 33.36,95.54 42.07,95.54 45.05,92.57 66.79,92.57 P1.2 70.02,94.71 73.01,97.7 77.71,97.7 78.73,98.72 85.2,98.72 89.78,94.15 96,94.15 98.11,92.04 98.11,81.28 94.66,77.84 C_2_LCD.1 ; C_1_LCD.1 90.57,67.35 88.81,67.35 87.41,68.75 87.41,72.53 85.98,73.97 2.2TFTLCD.VCC
  Bottom Layer w0.508: R10.2 5.91,96.88 C_2_RF.1 20.6,88.68 C_1_RF.1 ; C_2_LCD.1 94.13,76.19 C_1_LCD.1
VCC_5: length 87.3
  Top Layer w0.508: R3.2 91.92,81.41 89.6,83.73 89.6,91.12 83.78,96.94 80.02,96.94 77.79,94.71 P1.1
  Bottom Layer w0.508: R3.2 96.58,79.43 96.58,69.36 94.77,67.54 C_2_PICO.1 96.55,46.02 C_1_PICO.1 92.92,36.11 U15.39
BATTERY_ANALOG: length 74.2
  Top Layer w0.254: R1.2 54.34,43.78 44.61,34.05 44.61,28.61 47.84,25.39 77.89,25.39 80.22,27.72 U15.34
CE_DISPLAY: length 133.3
  Top Layer w0.254: 2.2TFTLCD.DC 82.24,84.12 76.21,78.09 v1(76.21,74.2) ; U15.20 47.2,14.82 49.44,17.06 95.4,17.06 98.05,19.7 98.05,54.77 v1(80.17,72.65)
  Bottom Layer w0.254: v1(76.21,74.2) 77.76,72.65 v1(80.17,72.65)
CE_RF: length 83.7
  Top Layer w0.254: v1(42.4,80.61) 47.39,75.62 v1(53.05,75.62)
  Bottom Layer w0.254: U15.26 59.9,34.86 63.46,38.42 63.46,73.6 61.44,75.62 v1(53.05,75.62) ; 32.19,86.67 32.19,82.77 33.69,81.27 41.74,81.27 v1(42.4,80.61)
CS_DISPLAY: length 121.9
  Top Layer w0.254: U15.19 49.74,15.66 50.38,16.29 95.72,16.29 98.81,19.39 98.81,55.09 80.71,73.19 80.71,76.76 2.2TFTLCD.CS
CS_RF: length 92.8
  Top Layer w0.254: v1(43.18,81.38) 47.85,76.71 v1(53.05,76.71)
  Bottom Layer w0.254: 32.19,89.2 32.19,89.21 32.19,91.61 34.15,93.56 38.52,93.56 42.2,89.88 42.2,82.36 v1(43.18,81.38) ; v1(53.05,76.71) 62.07,76.71 64.55,74.23 64.55,37.78 62.44,35.67 62.44,30.3
ENC_CLK: length 7.9
  Bottom Layer w0.254: ENCODER_PIN.5 55.07,12.27 54.82,12.52
ENC_DT: length 7.9
  Bottom Layer w0.254: U15.16 57.57,12.31 ENCODER_PIN.4
ENC_SW: length 7.9
  Bottom Layer w0.254: U15.15 60.07,12.35 ENCODER_PIN.3
IRQ_RF: length 20.4
  Bottom Layer w0.254: JMP_IRQ.1 72.25,43.07 67.52,38.34 67.52,30.3
MISO: length 121.5
  Top Layer w0.254: nRF24L01+PA+LNA.7 37.27,78.69 47.19,68.78 56.16,68.78 v1(61.71,63.22) 61.71,42.17 55.45,35.9 48.96,35.9 47.15,34.1 47.15,30.35 U15.21 ; v1(77.73,88.42) 61.71,72.4 v1(61.71,68.72)
  Bottom Layer w0.254: v1(77.73,88.42) 82.99,93.68 2.2TFTLCD.MISO ; v1(61.71,63.22) v1(61.71,68.72)
MOSI: length 119.8
  Top Layer w0.254: v1(62.55,68.72) 62.55,72.06 77.2,86.7 82.95,86.7 2.2TFTLCD.MOSI ; v1(39.61,83.45) 39.61,82.82 38.11,81.32 38.11,79.04 47.54,69.62 56.51,69.62 v1(62.55,63.57) 62.55,41.82 57.36,36.63 U15.25
  Bottom Layer w0.254: v1(62.55,63.57) v1(62.55,68.72) ; nRF24L01+PA+LNA.6 37.18,91.66 38.52,91.66 39.61,90.56 v1(39.61,83.45)
PIEZO: length 18.6
  Bottom Layer w0.254: 49.74,31.44 49.74,49.5 BUZZER.1
RUN: length 56.8
  Top Layer w0.254: RST.4 78.09,45.47 78.09,76.69 82.99,81.58
  Bottom Layer w0.254: RST.4 69.87,30.49 U15.30
SCK: length 112.8
  Top Layer w0.254: 2.2TFTLCD.SCK 77,89.2 60.64,72.85 v1(60.64,68.72) ; nRF24L01+PA+LNA.5 36.2,85.2 36.2,78.25 46.74,67.7 55.71,67.7 v1(60.64,62.78) 60.64,42.61 v1(56.07,38.04)
  Bottom Layer w0.254: 54.82,31.44 54.82,36.79 v1(56.07,38.04) ; v1(60.64,62.78) v1(60.64,68.72)
$1N9361: length 38.3
  Bottom Layer w0.508: P3.1 51.8,92.13 R1.1
$1N10835: length 6.1
  Bottom Layer w0.254: H2.2 R2.1
$1N10839: length 4.1
  Bottom Layer w0.254: BUZZER.2 R2.2
$1N17067: length 5.2
  Bottom Layer w0.254: R11.2 79.16,37.25 RST.2
$1N20120: length 62.5
  Top Layer w0.254: nRF24L01+PA+LNA.8 52.93,89.2 v1(56.68,85.46)
  Bottom Layer w0.254: JMP_IRQ.2 72.25,71.41 58.2,85.46 v1(56.68,85.46)
$1N20161: length 11.7
  Bottom Layer w0.254: 2.2TFTLCD.LED 83.12,91.61 R3.1
$1N20266: length 16.5
  Bottom Layer w0.254: 3.49,16.42 6.06,13.86 8.97,13.86 SWITCH_PIN.8 ; 3.49,16.42 R5.1 ; 3.49,16.42 R4.2
$1N20338: length 34.2
  Bottom Layer w0.254: SWITCH_PIN.6 7.23,20.6 7.23,37.14 R6.2 R7.1
$1N20340: length 24
  Bottom Layer w0.254: SWITCH_PIN.7 6.13,19.19 6.13,25.46 3.49,28.11 ; 3.49,28.11 R6.1 ; 3.49,28.11 R5.2
$1N20482: length 59
  Bottom Layer w0.254: 3.49,70.61 9.69,64.41 9.69,23.14 SWITCH_PIN.4 ; 3.49,70.61 R8.2 ; 3.49,70.61 R9.1
$1N20486: length 70.6
  Bottom Layer w0.254: 3.49,84.69 10.71,77.47 10.71,24.62 SWITCH_PIN.3 ; 3.49,84.69 R10.1 ; 3.49,84.69 R9.2
$1N20488: length 47.6
  Bottom Layer w0.254: SWITCH_PIN.5 8.47,21.86 8.47,51.77 3.49,56.75 ; R7.2 3.49,56.75 ; 3.49,56.75 R8.1
$1N20737: length 64.9
  Top Layer w0.254: U15.32 75.14,27.88 74,26.73 v1(48.63,26.73)
  Bottom Layer w0.254: SWITCH_PIN.1 13.62,26.71 39.79,26.71 39.81,26.73 v1(48.63,26.73)

Small or netless copper shapes (teardrops, artwork), in the pictures only: 7 on Top Layer

## Text on the board
Top Silkscreen Layer: GND | 3.3V | 5V | Controller Board V:2.0 / Marco Baldaccini | +V_Batt
